# Altium project PCB_Project.PrjPcb
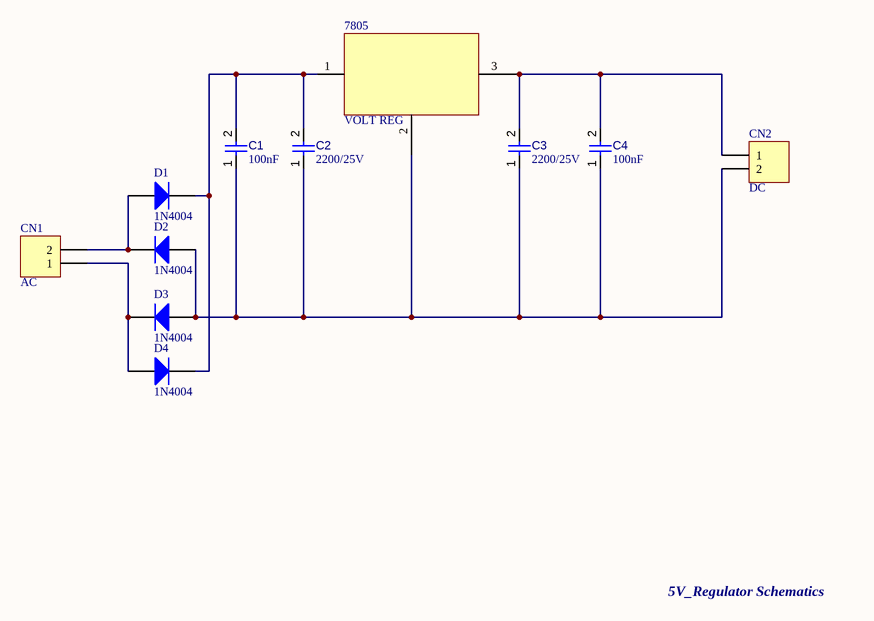
[diagram p0: 5V_Reg.SchDoc]
1 sheet, 11 parts. Net scope: global (net labels, ports and power ports of the same name join across sheets).
Board file: 5V_Reg.PcbDoc

## Sheet 5V_Reg.SchDoc
size A4; SheetNumber: 1; SheetTotal: 1

### Parts
7805  VOLT REG  [PCBComponent_1]
C1  value 100nF  [CAPC0402(1005)60_L]  (hidden comment: Capacitor 100nF +/-20% 50V 0402)
C2  value 2200/25V  [CAPC0402(1005)60_L]  (hidden comment: Capacitor 100nF +/-20% 50V 0402)
C3  value 2200/25V  [CAPC0402(1005)60_L]  (hidden comment: Capacitor 100nF +/-20% 50V 0402)
C4  value 100nF  [CAPC0402(1005)60_L]  (hidden comment: Capacitor 100nF +/-20% 50V 0402)
CN1  AC  [MHDR1X2]
CN2  DC  [MHDR1X2]
D1  1N4004  [FAIR-DO-41-2]
D2  1N4004  [FAIR-DO-41-2]
D3  1N4004  [FAIR-DO-41-2]
D4  1N4004  [FAIR-DO-41-2]

### Nets
Net7805_1: 7805.1 C1.2 C2.2 D1.2(K) D4.2(K)
Net7805_2: 7805.2 C1.1 C2.1 C3.1 C4.1 CN2.2 D2.1(A) D3.1(A)
Net7805_3: 7805.3 C3.2 C4.2 CN2.1
NetCN1_1: CN1.1 D3.2(K) D4.1(A)
NetCN1_2: CN1.2 D1.1(A) D2.2(K)

### Notes on the sheet
- 5V_Regulator Schematics

### Library data of the parts
C1-C4 = CMP-001-00067-3: Chip Capacitor, 100nF +/-20%, 50V, 0402, Thickness 0.6 mm; Tolerance: 10%; Min Operating Temperature: -55°C; Pins: 2; Case/Package: 0402; Max Operating Temperature: 85°C; Voltage Rating: 50V; Mounting Technology: SMT
CN1 CN2 = CMP-002-00208-1: Header, 2-Pin; Signal Integrity: Connector; Component Type: Standard; LatestRevisionDate: 17-Jul-2002; Design Item ID: MHDR1X2; Pins: 2; Publisher: Altium Limited; Source: Miscellaneous Connectors.SchLib; LatestRevisionNote: Re-released for DXP Platform.
D1-D4 = CMP-004-00004-2: General Purpose Rectifier, 400 V, 1 A, -55 to 175 degC, 2-Pin DO-204AL (DO-41), RoHS, Tape and Reel; Manufacturer: Fairchild Semiconductor; Forward Voltage: 1.1V; Forward Current: 1A; Max Surge Current: 30A; Package Version: Rev. 2, 09/2008; Peak Reverse Current: 50A; Case/Package: DO-41-2; Pins: 2; RoHS Compliant: True; Diameter: 2.72mm; Package Reference: DO-41-2; Datasheet URL: https://www.fairchildsemi.com/datasheets/1N/1N4004.pdf; Manufacturer URL: https://www.fairchildsemi.com/; Max Operating Temperature: 175°C; Datasheet Version: Rev. 1.1.0, 11/2014; Package URL: http://www.fairchildsemi.com/dwg/DO/DO41A.pdf; Package Quantity: 5000; Min Operating Temperature: -55°C; Package Description: 2-Pin Axial Lead, Dia 2.375 mm, Body Length 4.63 mm; Mounting Technology: TH; Packaging: TapeandReel